# Altium schematic sheet WL-ATT.SchDoc
size 420 x 297 mm; Address1: Address1; Address2: Address2; Address3: Address3; Address4: Address4; DocumentNumber: Wolf-Lite; SheetNumber: 7; Scale: 1:1; DocumentType: Схема электрическая принципиальная; FirstReferrence: UA3REO/R7KBI
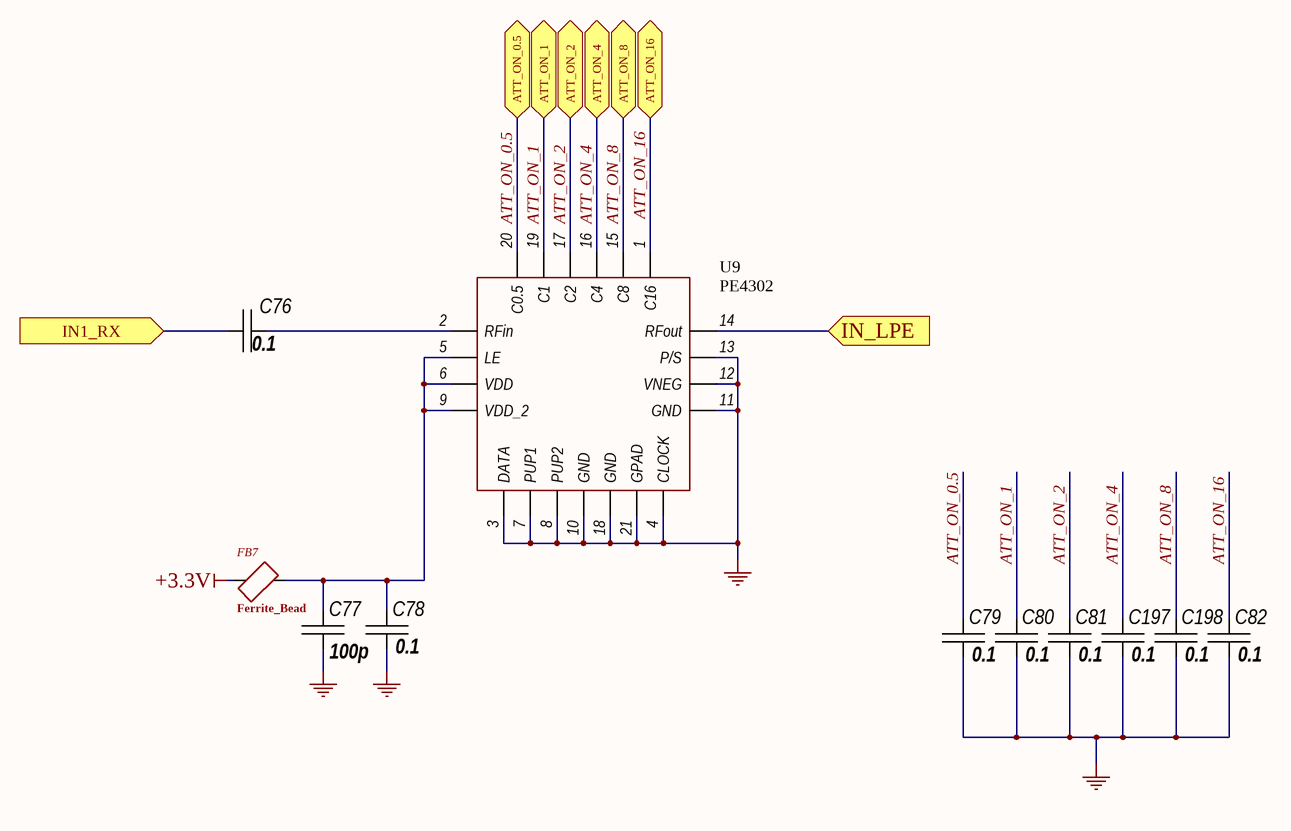
[diagram p0: WL-ATT.SchDoc]

## Parts
C76  0.1  [CH0805C]
C77  100p  [CH0805C]
C78  0.1  [CH0805C]
C79  0.1  [CH0805C]
C80  0.1  [CH0805C]
C81  0.1  [CH0805C]
C82  0.1  [CH0805C]
C197  0.1  [CH0805C]
C198  0.1  [CH0805C]
FB7  Ferrite_Bead  [CH0805L]
U9  PE4302  [20-QFN (4x4)]

## Ports
ATT_ON_0.5 (bidir), ATT_ON_1 (bidir), ATT_ON_2 (bidir), ATT_ON_4 (bidir), ATT_ON_8 (bidir), ATT_ON_16 (bidir), IN1_RX (in), IN_LPE (in)

## Nets
+3.3V: FB7.2
GND: C77.1 C78.1 C79.1 C80.1 C81.1 C82.1 C197.1 C198.1 U9.3(DATA) U9.4(CLOCK) U9.7(PUP1) U9.8(PUP2) U9.10(GND) U9.11(GND) U9.12(VNEG) U9.13(P/S) U9.18(GND) U9.21(GPAD)
ATT_ON_0.5: C79.2 U9.20(C0.5) ; port ATT_ON_0.5
ATT_ON_1: C80.2 U9.19(C1) ; port ATT_ON_1
ATT_ON_2: C81.2 U9.17(C2) ; port ATT_ON_2
ATT_ON_4: C197.2 U9.16(C4) ; port ATT_ON_4
ATT_ON_8: C198.2 U9.15(C8) ; port ATT_ON_8
ATT_ON_16: C82.2 U9.1(C16) ; port ATT_ON_16
IN1_RX: C76.1 ; port IN1_RX
IN_LPE: U9.14(RFout) ; port IN_LPE
NetC76_2: C76.2 U9.2(RFin)
NetC77_2: C77.2 C78.2 FB7.1 U9.5(LE) U9.6(VDD) U9.9(VDD_2)

## Notes on the sheet
- Подп. и дата
- Инв. № дубл.
- Взам. инв. №
- Инв. № подл.
- Изм.
- Лист
- № докум.
- Подп.
- Дата
- 2.106-A3
- Копировал
- Формат А3

## Library data of the parts
C76-C82 C197 C198 = Capacitor: Manufacturer: *; Model: *; HelpURL: *; ComponentKind: *; Value: *
FB7 = FB